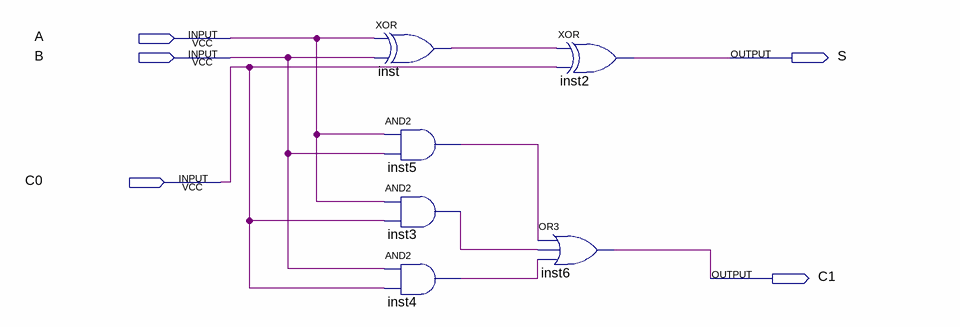
[diagram p0: schematic sheet]
// Quartus schematic addx1.bdf as structural Verilog: 6 symbols, 5 pins
module addx1 (
  input  A,
  input  B,
  input  C0,
  output S,
  output C1
);

  wire inst3_out, inst4_out, inst5_out, inst_out;

  xor inst (inst_out, A, B);
  and inst5 (inst5_out, A, B);
  and inst3 (inst3_out, A, C0);
  and inst4 (inst4_out, B, C0);
  or inst6 (C1, inst5_out, inst3_out, inst4_out);
  xor inst2 (S, inst_out, C0);
endmodule
